# Altium schematic sheet MCU.SchDoc: MCU
size A3; DocumentNumber: MB1137; Revision: B-01; SheetNumber: 2; SheetTotal: 6; Project: NUCLEO-XXXXZX
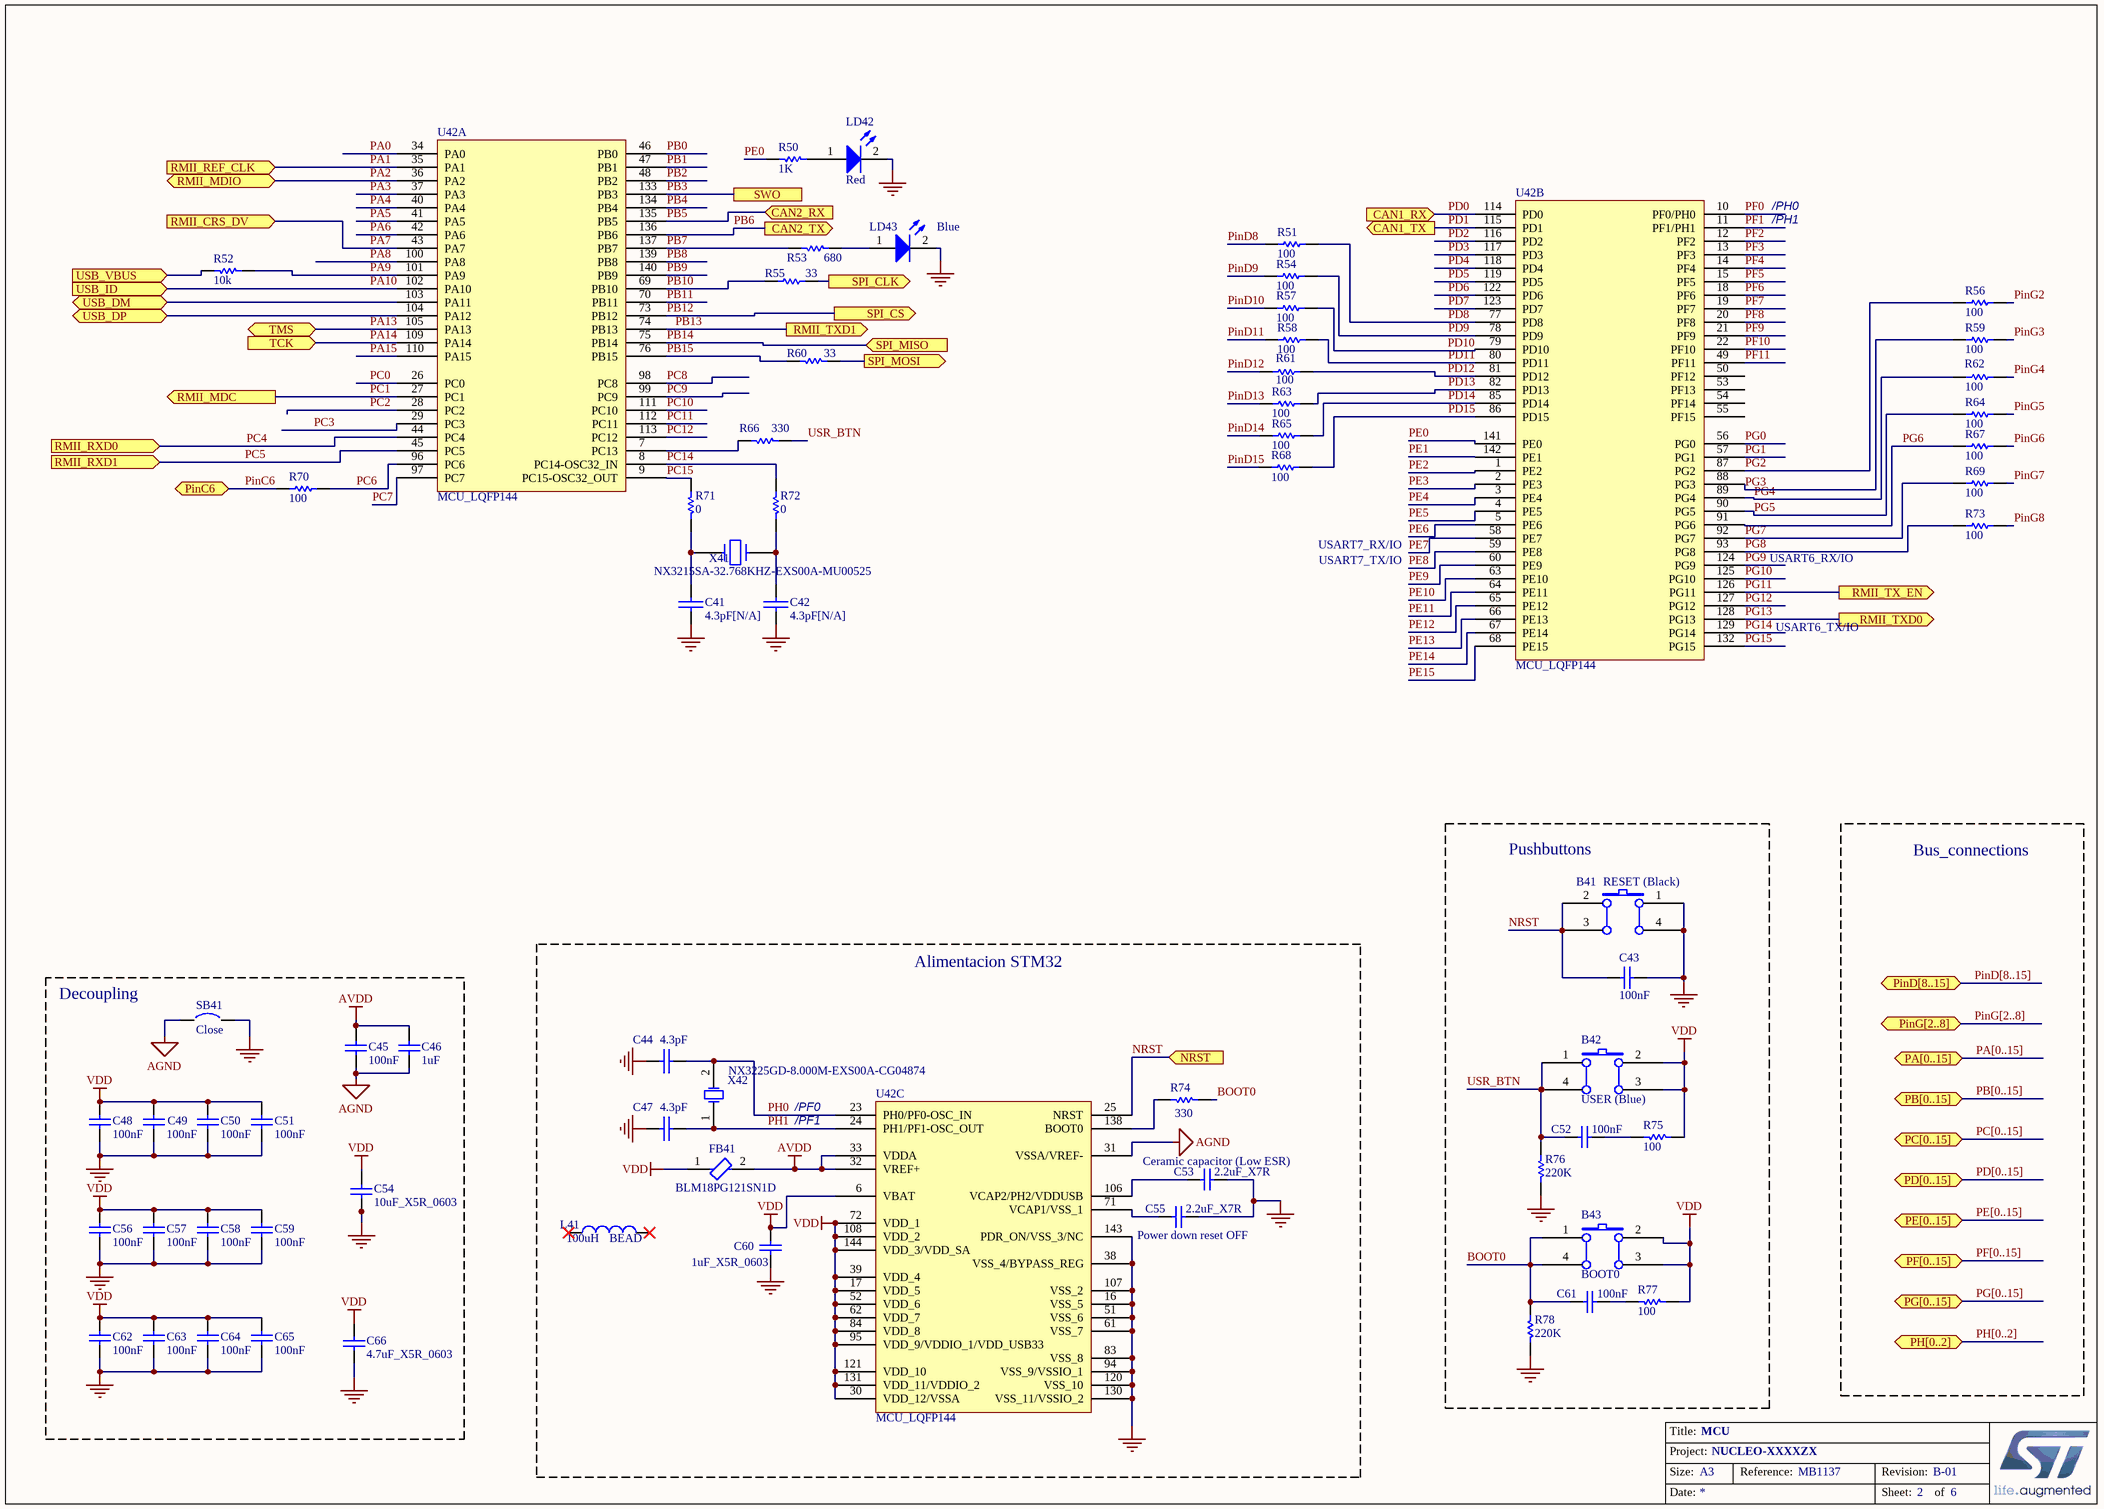
[diagram p0: MCU.SchDoc]

## Parts
B41  RESET (Black)  [PB-6X6mm-Black]
B42  USER (Blue)  [PB-6X6mm-Blue]
B43  BOOT0  [PB-6X6mm-Blue]
C41  4.3pF[N/A]  [0603C]
C42  4.3pF[N/A]  [0603C]
C43  100nF  [0603C]
C44  4.3pF  [0603C]
C45  100nF  [0603C]
C46  1uF  [0603C]
C47  4.3pF  [0603C]
C48  100nF  [0603C]
C49  100nF  [0603C]
C50  100nF  [0603C]
C51  100nF  [0603C]
C52  100nF  [0603C]
C53  2.2uF_X7R  [TAN-A]
C54  10uF_X5R_0603  [0603C]
C55  2.2uF_X7R  [TAN-A]
C56  100nF  [0603C]
C57  100nF  [0603C]
C58  100nF  [0603C]
C59  100nF  [0603C]
C60  1uF_X5R_0603  [0603C]
C61  100nF  [0603C]
C62  100nF  [0603C]
C63  100nF  [0603C]
C64  100nF  [0603C]
C65  100nF  [0603C]
C66  4.7uF_X5R_0603  [0603C]
FB41  BLM18PG121SN1D  [FP-BLM18-0_15-t0_8-IPC_A]
L41  BEAD  value 100uH  (graphical)
LD42  Red  [0603D-R]
LD43  Blue  [0603D-B]
R50  1K  [0603R]
R51  100  [0603R]
R52  10k  [0603R]
R53  680  [0603R]
R54  100  [0603R]
R55  33  [0603R]
R56  100  [0603R]
R57  100  [0603R]
R58  100  [0603R]
R59  100  [0603R]
R60  33  [0603R]
R61  100  [0603R]
R62  100  [0603R]
R63  100  [0603R]
R64  100  [0603R]
R65  100  [0603R]
R66  330  [0603R]
R67  100  [0603R]
R68  100  [0603R]
R69  100  [0603R]
R70  100  [0603R]
R71  0  [0603R]
R72  0  [0603R]
R73  100  [0603R]
R74  330  [0603R]
R75  100  [0603R]
R76  220K  [0603R]
R77  100  [0603R]
R78  220K  [0603R]
SB41  Close  [SB_0603]
U42  MCU_LQFP144  [LQFP144_0R5_SKT - sin_zocalo_UWU]  (parts A,B,C of 3)
X41  NX3215SA-32.768KHZ-EXS00A-MU00525  [XTAL_2SM_3R2X1R5]
X42  NX3225GD-8.000M-EXS00A-CG04874  [OSC_2SM_3R2x2R5]

## Blocks framed on the sheet
Pushbuttons: B41-B43 C43 C52 C61 R75-R78
Decoupling: C45 C46 C48-C51 C54 C56-C59 C62-C66 SB41
Alimentacion STM32: C44 C47 C53 C55 C60 FB41 L41 R74 U42 X42

## Ports
CAN1_RX (in), CAN1_TX (out), CAN2_RX (in), CAN2_TX (out), NRST (in), PA[0..15] (bidir), PB[0..15] (bidir), PC[0..15] (bidir), PD[0..15] (bidir), PE[0..15] (bidir), PF[0..15] (bidir), PG[0..15] (bidir), PH[0..2] (bidir), PinC6 (bidir), PinD[8..15] (bidir), PinG[2..8] (bidir), RMII_CRS_DV (in), RMII_MDC (out), RMII_MDIO (bidir), RMII_REF_CLK (in), RMII_RXD0 (in), RMII_RXD1 (in), RMII_TX_EN (out), RMII_TXD0 (out), RMII_TXD1 (out), SPI_CLK (out), SPI_CS (out), SPI_MISO (in), SPI_MOSI (out), SWO, TCK (in), TMS (bidir), USB_DM (bidir), USB_DP (bidir), USB_ID (in), USB_VBUS (in)

## Nets
AGND: C45.2 C46.2 SB41.1 U42.31(VSSA/VREF-)
AVDD: C45.1 C46.1 FB41.2 U42.32(VREF+) U42.33(VDDA)
GND: B41.1(A0) B41.4(A1) C41.2 C42.2 C43.1 C44.2 C47.2 C48.2 C49.2 C50.2 C51.2 C53.2 C54.2 C55.2 C56.2 C57.2 C58.2 C59.2 C60.2 C62.2 C63.2 C64.2 C65.2 C66.2 LD42.2(K) LD43.2(K) R76.2 R78.2 SB41.2 U42.16(VSS_5) U42.38(VSS_4/BYPASS_REG) U42.51(VSS_6) U42.61(VSS_7) U42.83(VSS_8) U42.94(VSS_9/VSSIO_1) U42.107(VSS_2) U42.120(VSS_10) U42.130(VSS_11/VSSIO_2) U42.143(PDR_ON/VSS_3/NC)
VDD: B42.2(B0) B42.3(B1) B43.2(B0) B43.3(B1) C48.1 C49.1 C50.1 C51.1 C54.1 C56.1 C57.1 C58.1 C59.1 C60.1 C62.1 C63.1 C64.1 C65.1 C66.1 FB41.1 R75.1 R77.1 U42.6(VBAT) U42.17(VDD_5) U42.30(VDD_12/VSSA) U42.39(VDD_4) U42.52(VDD_6) U42.62(VDD_7) U42.72(VDD_1) U42.84(VDD_8) U42.95(VDD_9/VDDIO_1/VDD_USB33) U42.108(VDD_2) U42.121(VDD_10) U42.131(VDD_11/VDDIO_2) U42.144(VDD_3/VDD_SA)
BOOT0: B43.1(A0) B43.4(A1) C61.2 R74.2 R78.1
NRST: B41.2(B0) B41.3(B1) C43.2 U42.25(NRST) ; port NRST
PA0: U42.34(PA0)
PA1: U42.35(PA1) ; port RMII_REF_CLK
PA2: U42.36(PA2) ; port RMII_MDIO
PA3: U42.37(PA3)
PA4: U42.40(PA4)
PA5: U42.41(PA5)
PA6: U42.42(PA6)
PA7: U42.43(PA7) ; port RMII_CRS_DV
PA8: U42.100(PA8)
PA9: R52.2 U42.101(PA9)
PA10: U42.102(PA10) ; port USB_ID
PA13: U42.105(PA13) ; port TMS
PA14: U42.109(PA14) ; port TCK
PA15: U42.110(PA15)
PB0: U42.46(PB0)
PB1: U42.47(PB1)
PB2: U42.48(PB2)
PB3: U42.133(PB3) ; port SWO
PB4: U42.134(PB4)
PB5: U42.135(PB5) ; port CAN2_RX
PB6: U42.136(PB6) ; port CAN2_TX
PB7: R53.1 U42.137(PB7)
PB8: U42.139(PB8)
PB9: U42.140(PB9)
PB10: R55.1 U42.69(PB10)
PB11: U42.70(PB11)
PB12: U42.73(PB12) ; port SPI_CS
PB13: U42.74(PB13) ; port RMII_TXD1
PB14: U42.75(PB14) ; port SPI_MISO
PB15: R60.1 U42.76(PB15)
PC0: U42.26(PC0)
PC1: U42.27(PC1) ; port RMII_MDC
PC2: U42.28(PC2)
PC3: U42.29(PC3)
PC4: U42.44(PC4) ; port RMII_RXD0
PC5: U42.45(PC5) ; port RMII_RXD1
PC6: R70.2 U42.96(PC6)
PC7: U42.97(PC7)
PC8: U42.98(PC8)
PC9: U42.99(PC9)
PC10: U42.111(PC10)
PC11: U42.112(PC11)
PC12: U42.113(PC12)
PC14: R72.2 U42.8(PC14-OSC32_IN)
PC15: R71.2 U42.9(PC15-OSC32_OUT)
PD0: U42.114(PD0) ; port CAN1_RX
PD1: U42.115(PD1) ; port CAN1_TX
PD2: U42.116(PD2)
PD3: U42.117(PD3)
PD4: U42.118(PD4)
PD5: U42.119(PD5)
PD6: U42.122(PD6)
PD7: U42.123(PD7)
PD8: R51.1 U42.77(PD8)
PD9: R54.1 U42.78(PD9)
PD10: R57.1 U42.79(PD10)
PD11: R58.1 U42.80(PD11)
PD12: R61.1 U42.81(PD12)
PD13: R63.2 U42.82(PD13)
PD14: R65.1 U42.85(PD14)
PD15: R68.2 U42.86(PD15)
PE0: R50.2 U42.141(PE0)
PE1: U42.142(PE1)
PE2: U42.1(PE2)
PE3: U42.2(PE3)
PE4: U42.3(PE4)
PE5: U42.4(PE5)
PE6: U42.5(PE6)
PE7: U42.58(PE7)
PE8: U42.59(PE8)
PE9: U42.60(PE9)
PE10: U42.63(PE10)
PE11: U42.64(PE11)
PE12: U42.65(PE12)
PE13: U42.66(PE13)
PE14: U42.67(PE14)
PE15: U42.68(PE15)
PF0: U42.10(PF0/PH0)
PF1: U42.11(PF1/PH1)
PF2: U42.12(PF2)
PF3: U42.13(PF3)
PF4: U42.14(PF4)
PF5: U42.15(PF5)
PF6: U42.18(PF6)
PF7: U42.19(PF7)
PF8: U42.20(PF8)
PF9: U42.21(PF9)
PF10: U42.22(PF10)
PF11: U42.49(PF11)
PG0: U42.56(PG0)
PG1: U42.57(PG1)
PG2: R56.2 U42.87(PG2)
PG3: R59.2 U42.88(PG3)
PG4: R62.1 U42.89(PG4)
PG5: R64.1 U42.90(PG5)
PG6: R67.2 U42.91(PG6)
PG7: R69.2 U42.92(PG7)
PG8: R73.2 U42.93(PG8)
PG9: U42.124(PG9)
PG10: U42.125(PG10)
PG11: U42.126(PG11) ; port RMII_TX_EN
PG12: U42.127(PG12)
PG13: U42.128(PG13) ; port RMII_TXD0
PG14: U42.129(PG14)
PG15: U42.132(PG15)
PH0: C44.1 U42.23(PH0/PF0-OSC_IN) X42.2(OSC2)
PH1: C47.1 U42.24(PH1/PF1-OSC_OUT) X42.1(OSC1)
PinC6: R70.1 ; port PinC6
PinD8: R51.2
PinD9: R54.2
PinD10: R57.2
PinD11: R58.2
PinD12: R61.2
PinD13: R63.1
PinD14: R65.2
PinD15: R68.1
PinG2: R56.1
PinG3: R59.1
PinG4: R62.2
PinG5: R64.2
PinG6: R67.1
PinG7: R69.1
PinG8: R73.1
SPI_CLK: R55.2 ; port SPI_CLK
SPI_MOSI: R60.2 ; port SPI_MOSI
USB_DM: U42.103(PA11) ; port USB_DM
USB_DP: U42.104(PA12) ; port USB_DP
USB_VBUS: R52.1 ; port USB_VBUS
USR_BTN: B42.1(A0) B42.4(A1) C52.2 R66.1 R76.1
NetC41_1: C41.1 R71.1 X41.1
NetC42_1: C42.1 R72.1 X41.2
NetC52_1: C52.1 R75.2
NetC53_1: C53.1 U42.106(VCAP2/PH2/VDDUSB)
NetC55_1: C55.1 U42.71(VCAP1/VSS_1)
NetC61_1: C61.1 R77.2
NetLD42_1: LD42.1(A) R50.1
NetLD43_1: LD43.1(A) R53.2
NetR66_2: R66.2 U42.7(PC13)
NetR74_1: R74.1 U42.138(BOOT0)

Not connected (* = marked no-connect by the designer): L41 1* 2*; U42 50(PF12) 53(PF13) 54(PF14) 55(PF15)

## Buses and harness runs
bus PA[0..15] = port PA[0..15]
bus PB[0..15] = port PB[0..15]
bus PC[0..15] = port PC[0..15]
bus PD[0..15] = port PD[0..15]
bus PE[0..15] = port PE[0..15]
bus PF[0..15] = port PF[0..15]
bus PG[0..15] = port PG[0..15]
bus PH[0..2] = port PH[0..2]
bus PinD[8..15] = port PinD[8..15]
bus PinG[2..8] = port PinG[2..8]

## Notes on the sheet
- /PH0
- /PH1
- USART7_TX/IO
- USART7_RX/IO
- USART6_RX/IO
- USART6_TX/IO
- Bus_connections
- /PF0
- /PF1
- (near C53) Ceramic capacitor (Low ESR)
- (near C55) Power down reset OFF
- Title:
- Project:
- Size:
- Date:
- A3
- Reference:
- Sheet:
- Revision:
- of

## Library data of the parts
B41-B43 = SW PUSHBUTTON: SE PUSHBUTTON
C41 C42 C44 C47 = CAP: Capacitor
C43 C52 C61 = CAP: Capacitor; Value: 100pF; Published: 8-Jun-2000; Revision: July-2002: Re-released for DXP Platform.; Publisher: Altium Limited
C45 C46 C48-C51 C56-C59 C62-C65 = Cap: Capacitor; Value: 10nF; Published: 8-Jun-2000; Revision: July-2002: Re-released for DXP Platform.; Publisher: Altium Limited
C53 C55 = Cap_2.2uF_X7R_10%_0805: Capacitor,2.2uF,16V, X7R,10%,0805,YAGEO; Manuf_Part_1: CC0805KKX7R7BB225; Revision: July-2002: Re-released for DXP Platform.; Value: 2.2uF; Order: CC0805KKX7R7BB225; Manuf_1: YAGEO
C54 C66 = CAP SMD 0603  X5R 1µF 25V 10%: 0603  X5R 4.7uF; Value: 1µF; Rated voltage: 25V; Tolerance: 10%; Manufacturer: *; Manufacturer P/N: *; Order code Farnell: 1288202RL; Power: *; Technology: X5R; Temperature  Factor: *; Temperature Max: +125°C; Temperature Min: -55°C; STS Code: *
C60 = CAP SMD 0603  X5R 1µF 25V 10%: 0603  X5R 1µF; Rated voltage: 25V; Tolerance: 10%; Manufacturer: *; Manufacturer P/N: *; Order code Farnell: 1288202RL; Value: 1µF; Power: *; Technology: X5R; Temperature  Factor: *; Temperature Max: +125°C; Temperature Min: -55°C; STS Code: *
FB41 = CMP-0686-00557-7: Chip Ferrite Bead, 0603, 120Ω @ 100MHz, 0.05Ω, 25%, 2A; Impedance: 120R; Number of Circuits: 1; Shielding: Unshielded; Material: Steel; DC Resistance (DCR): 50mR; Case Code (Imperial): 0603; RoHS Compliant: Yes; Number of Pins: 2; Min Operating Temperature: -55°C; Case Code (Metric): 1608; Frequency: 100MHz; Length: 1.6mm; Test Frequency: 100MHz; Max Operating Temperature: 125°C; Packaging: Tape and Reel; Max Current Rating: 2A; Termination: SMD/SMT; Lead Free: Lead Free; Max DC Current: 2A; Case/Package: 0603; Height: 0.8mm; Current Rating: 2A; Radiation Hardening: No; Core Material: Ferrite; DC Current: 2A; REACH SVHC: No SVHC; Package Quantity: 1; Depth: 0.8mm; Number of Lines: 1; Tolerance: 25%; Width: 0.8mm
L41 = Inductor: Published: 8-Jun-2000; Revision: July-2002: Re-released for DXP Platform.; Publisher: Altium Limited
LD42 LD43 = LED2: Typical RED, GREEN, YELLOW, AMBER GaAs LED; Published: 8-Jun-2000; Revision: July-2002: Re-released for DXP Platform.; Publisher: Altium Limited
R50 = Res1: Resistor; Published: 8-Jun-2000; Revision: July-2002: Re-released for DXP Platform.; Publisher: Altium Limited; Value: 1K
R51 R54 R56-R59 R61-R65 R67-R70 R73 = Resistor_ST: Resistor 0402 / 0603 / 0805; Value: 10K
R52 R53 R60 R66 R71 R72 R74 R75 R77 = Res1: Resistor; Value: 1K; Published: 8-Jun-2000; Revision: July-2002: Re-released for DXP Platform.; Publisher: Altium Limited
R55 = Res1: Resistor; Ordered by: Subcon; Value: 33; Published: 8-Jun-2000; Revision: July-2002: Re-released for DXP Platform.; Publisher: Altium Limited
R76 R78 = res1: Resistor; Value: 1K; Published: 8-Jun-2000; Revision: July-2002: Re-released for DXP Platform.; Publisher: Altium Limited
SB41 = Circuit Breaker: Published: 24-Mar-1999; Revision: July-2002: Re-released for DXP Platform.; Publisher: Altium Limited
X41 = CRYSTAL_32K: Crystal
X42 = XTAL: Crystal Oscillator; Published: 8-Jun-2000; LatestRevisionDate: 17-Jul-2002; LatestRevisionNote: Re-released for DXP Platform.; PackageReference: R38; Publisher: Altium Limited